# Altium schematic sheet ledsbuttons.SchDoc
size A4; SheetNumber: 14; SheetTotal: 15
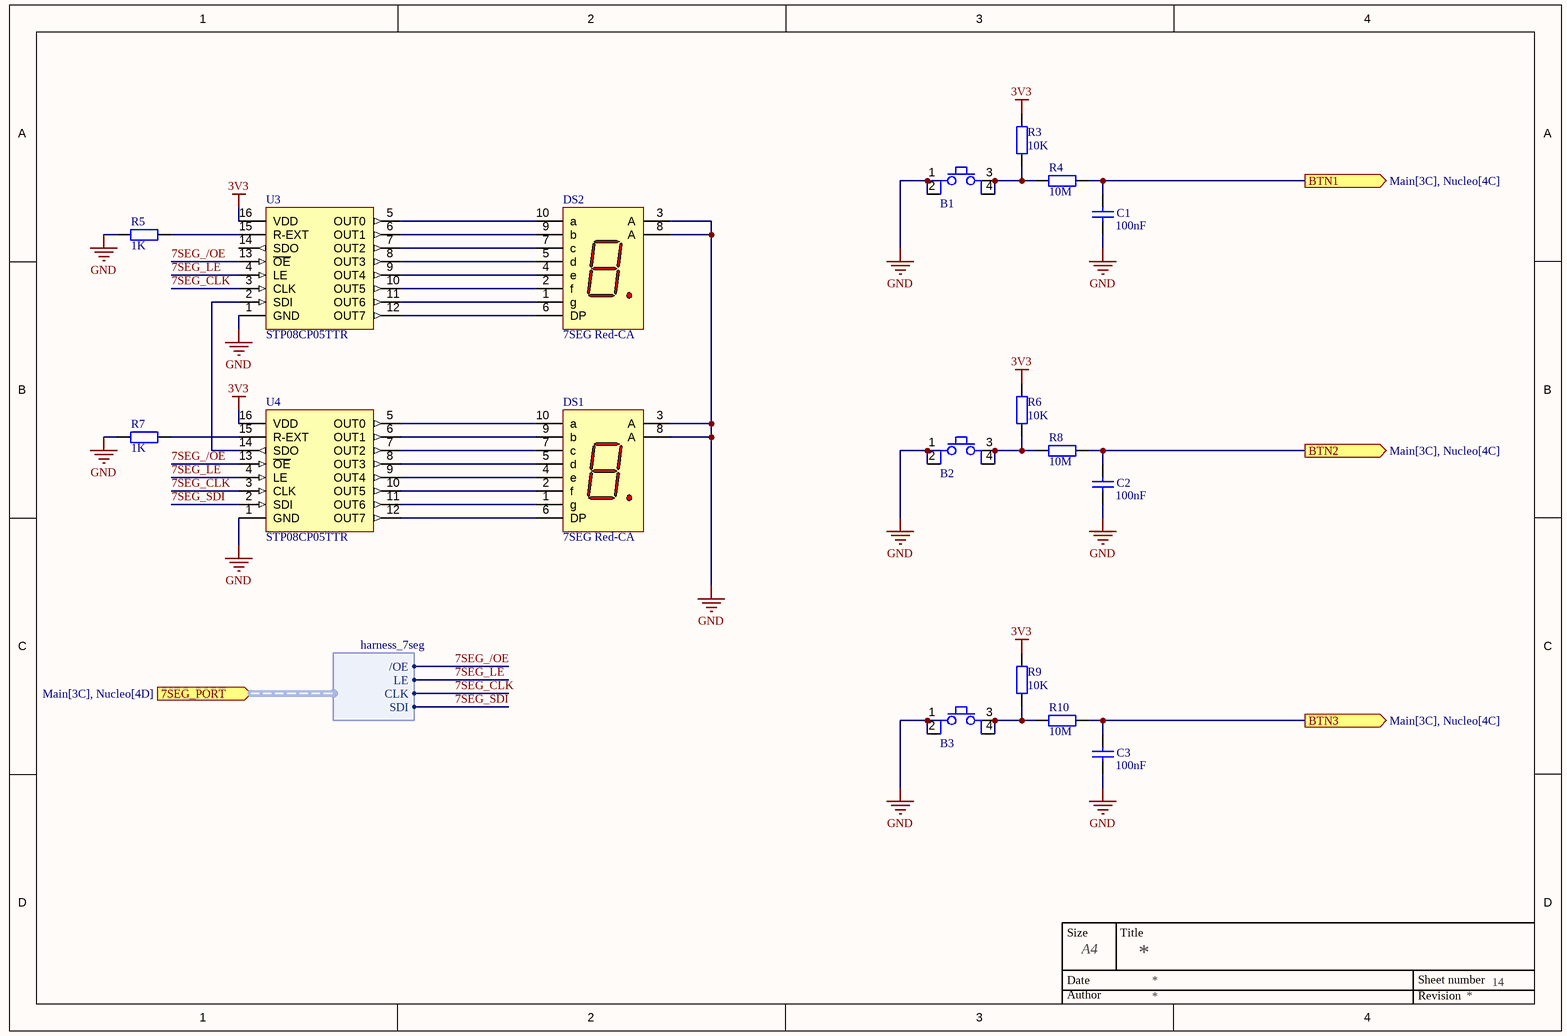
[diagram p0: ledsbuttons.SchDoc]

## Parts
B1  Button  [FP_BTN_SMD]  (value not drawn)
B2  Button  [FP_BTN_SMD]  (value not drawn)
B3  Button  [FP_BTN_SMD]  (value not drawn)
C1  100nF  [FP_0805_CAP_085]
C2  100nF  [FP_0805_CAP_085]
C3  100nF  [FP_0805_CAP_085]
DS1  7SEG Red-CA  [FP_7SEG]
DS2  7SEG Red-CA  [FP_7SEG]
R3  10K  [FP_0805_RES]
R4  10M  [FP_0805_RES]
R5  1K  [FP_0805_RES]
R6  10K  [FP_0805_RES]
R7  1K  [FP_0805_RES]
R8  10M  [FP_0805_RES]
R9  10K  [FP_0805_RES]
R10  10M  [FP_0805_RES]
U3  STP08CP05TTR  [TSOP65P640X120-16M]
U4  STP08CP05TTR  [TSOP65P640X120-16M]

## Ports
7SEG_PORT (in, harness harness_7seg, see Main[3C], Nucleo[4D]), BTN1 (out, see Main[3C], Nucleo[4C]), BTN2 (out, see Main[3C], Nucleo[4C]), BTN3 (out, see Main[3C], Nucleo[4C])

## Harnesses
harness_7seg: /OE, LE, CLK, SDI

## Nets
3V3: R3.2 R6.2 R9.2 U3.16(VDD) U4.16(VDD)
GND: B1.1 B1.2 B2.1 B2.2 B3.1 B3.2 C1.1 C2.1 C3.1 DS1.3(A) DS1.8(A) DS2.3(A) DS2.8(A) R5.2 R7.1 U3.1(GND) U4.1(GND)
7SEG_/OE: U3.13(~{OE}) U4.13(~{OE}) ; port 7SEG_PORT./OE
7SEG_CLK: U3.3(CLK) U4.3(CLK) ; port 7SEG_PORT.CLK
7SEG_LE: U3.4(LE) U4.4(LE) ; port 7SEG_PORT.LE
7SEG_SDI: U4.2(SDI) ; port 7SEG_PORT.SDI
BTN1: C1.2 R4.1 ; port BTN1
BTN2: C2.2 R8.1 ; port BTN2
BTN3: C3.2 R10.1 ; port BTN3
NetB1_3: B1.3 B1.4 R3.1 R4.2
NetB2_3: B2.3 B2.4 R6.1 R8.2
NetB3_3: B3.3 B3.4 R9.1 R10.2
NetDS1_1: DS1.1(g) U4.11(OUT6)
NetDS1_2: DS1.2(f) U4.10(OUT5)
NetDS1_4: DS1.4(e) U4.9(OUT4)
NetDS1_5: DS1.5(d) U4.8(OUT3)
NetDS1_6: DS1.6(DP) U4.12(OUT7)
NetDS1_7: DS1.7(c) U4.7(OUT2)
NetDS1_9: DS1.9(b) U4.6(OUT1)
NetDS1_10: DS1.10(a) U4.5(OUT0)
NetDS2_1: DS2.1(g) U3.11(OUT6)
NetDS2_2: DS2.2(f) U3.10(OUT5)
NetDS2_4: DS2.4(e) U3.9(OUT4)
NetDS2_5: DS2.5(d) U3.8(OUT3)
NetDS2_6: DS2.6(DP) U3.12(OUT7)
NetDS2_7: DS2.7(c) U3.7(OUT2)
NetDS2_9: DS2.9(b) U3.6(OUT1)
NetDS2_10: DS2.10(a) U3.5(OUT0)
NetR5_1: R5.1 U3.15(R-EXT)
NetR7_2: R7.2 U4.15(R-EXT)
NetU3_2: U3.2(SDI) U4.14(SDO)

Not connected (* = marked no-connect by the designer): U3 14(SDO)

## Notes on the sheet
- Size
- Date
- A4
- Title
- Sheet number
- Author
- Revision

## Library data of the parts
B1-B3 = Button 4P: Push button; Name: TACT 6x 6 4P SPST 2 FSM4JSMA 4-1437565-1 (TYC) 50mA 12VDC SMD H=5mm 160g BLACK HEAD; Reference: 45-05-43; Supplier: Lomex
C1-C3 = CAP: Capacitor; Name: 100nF 0805 10% 50V X7R 0805B104K500NT (FNG); Supplier: Lomex; Reference: 82-13-46; Value: 100nF
DS1 DS2 = 7SEG Red-CA: 7-Segment Display: CA, RH DP; MinimumIntensity: 360 ucd; Note: IF = 5 mA; Colour: High Efficiency Red (HER); Note: Pins 1 and 6 are redundant Anodes.; Name: FYS-3911BUHR-21 (FYL) 7 SEG SRED COM.AN. 10mm 30mcd 10x13x7mm 640nm; Published: 8-Jun-2000; LatestRevisionDate: 17-Dec-2003; LatestRevisionNote: Schematic revised, PCB Footprint replaced.; DatasheetVersion: 19-Feb-2002; PackageVersion: 11-Feb-2002; PackageReference: A; Publisher: Altium Limited; PackageDescription: LED, 7-Segment Display, 7.62 mm, RHD; 10 Leads; Row Space 5.08 mm; Pitch 2.54 mm; ComponentLink1Description: Manufacturer Link; ComponentLink1URL: http://www.agilent.com/; Reference: 35-03-94; Supplier: Lomex
R3 R6 R9 = RES: Resistor; Name: 10K0 0805 5% CR-05JL7---10K 0.125W (VIK); Supplier: Lomex; Reference: 81-10-99; Value: 10K
R4 R8 R10 = RES: Resistor; Name: 10M0 0805 5% CR-05JL7---10M 0.125W (VIK); Supplier: Lomex; Reference: 81-11-84; Value: 10M
R5 R7 = RES: Resistor; Name: 1K00 0805 5% CR-05JL7----1K 0.125W (VIK); Supplier: Lomex; Reference: 81-10-87; Value: 1K
U3 U4 = STP08CP05TTR: Low voltage, low current power 8-bit shift register; Supplier: tanszék; Reference: STP08CP05TTR; Name: STP08CP05TTR